# Altium schematic sheet ACCELEROMETER.SchDoc
size OrCAD A; SheetNumber: 19; SheetTotal: 22
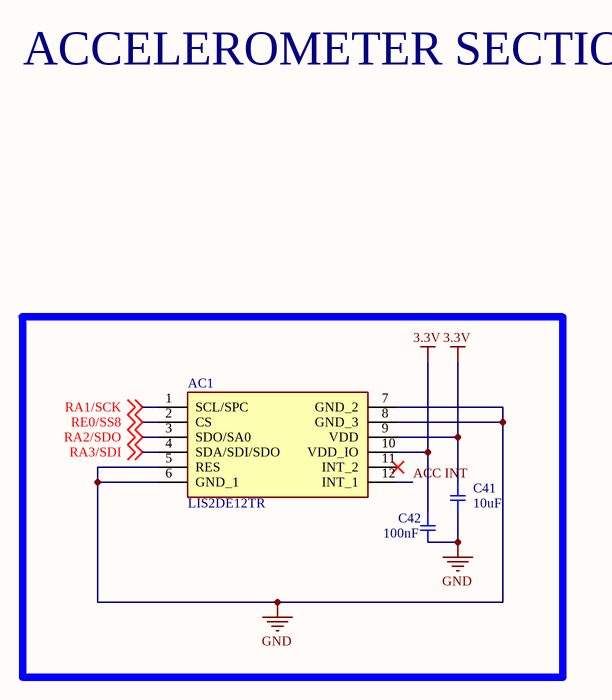
[diagram p0: ACCELEROMETER.SchDoc]

## Parts
AC1  LIS2DE12TR  [LIS2DE12TR]
C41  10uF  [SMD-0805C]
C42  100nF  [SMD-0805C]

## Nets
3.3V: AC1.9(VDD) AC1.10(VDD_IO) C41.1 C42.1
GND: AC1.5(RES) AC1.6(GND_1) AC1.7(GND_2) AC1.8(GND_3) C41.2 C42.2
ACC INT: AC1.12(INT_1)
RA1/SCK: AC1.1(SCL/SPC) ; off-sheet RA1/SCK
RA2/SDO: AC1.3(SDO/SA0) ; off-sheet RA2/SDO
RA3/SDI: AC1.4(SDA/SDI/SDO) ; off-sheet RA3/SDI
RE0/SS8: AC1.2(CS) ; off-sheet RE0/SS8

Not connected (* = marked no-connect by the designer): AC1 11(INT_2)*

## Notes on the sheet
- ACCELEROMETER SECTION

## Library data of the parts
AC1 = LIS2DE12TR: Accelerometer; Manufacturer_Name: STMicroelectronics; Datasheet Link: https://www.mouser.co.uk/datasheet/2/389/dm00153214-1798409.pdf; Height: 1mm; Manufacturer_Part_Number: LIS2DE12TR; Mouser Part Number: 511-LIS2DE12TR; Mouser Price/Stock: https://www.mouser.co.uk/ProductDetail/STMicroelectronics/LIS2DE12TR?qs=e%2Fel81Nv5iw4m6D8fXXMWA%3D%3D; Arrow Part Number: LIS2DE12TR; Arrow Price/Stock: https://www.arrow.com/en/products/lis2de12tr/stmicroelectronics
C41 C42 = GCD21BR71H104KA01L: CAP CER 0.1UF 50V X7R 0805; Manufacturer: Murata Electronics North America; Factory Stock: 0; Unit Price (USD): 0.24; Minimum Quantity: 1; Value: 0.10µF; Tolerance: ±10%; Datasheets: http://www.murata.com/~/media/webrenewal/support/library/catalog/products/capacitor/mlcc/c03e.ashx; Image: //media.digikey.com/Renders/Murata%20Renders/0805%28GxM6%29.jpg; Digi-Key Part Number: 490-11955-1-ND; Part Number: GCD21BR71H104KA01L; Quantity Available: 157; @ qty: 0; Packaging: Cut Tape (CT); Series: GCD; Part Status: Active; Voltage: 50V; Temperature Coefficient: X7R; Operating Temperature: -55°C ~ 125°C; Features: -; Ratings: AEC-Q200; Applications: Automotive; Mounting Type: Surface Mount, MLCC; Package / Case: 0805 (2012 Metric); Size / Dimension: 0.079" L x 0.049" W (2.00mm x 1.25mm); Height - Seated (Max): -; Thickness (Max): 0.049" (1.25mm); Lead Spacing: -; Lead Style: -